# EAGLE design AudioAmp_V1 (EAGLE 6.1)
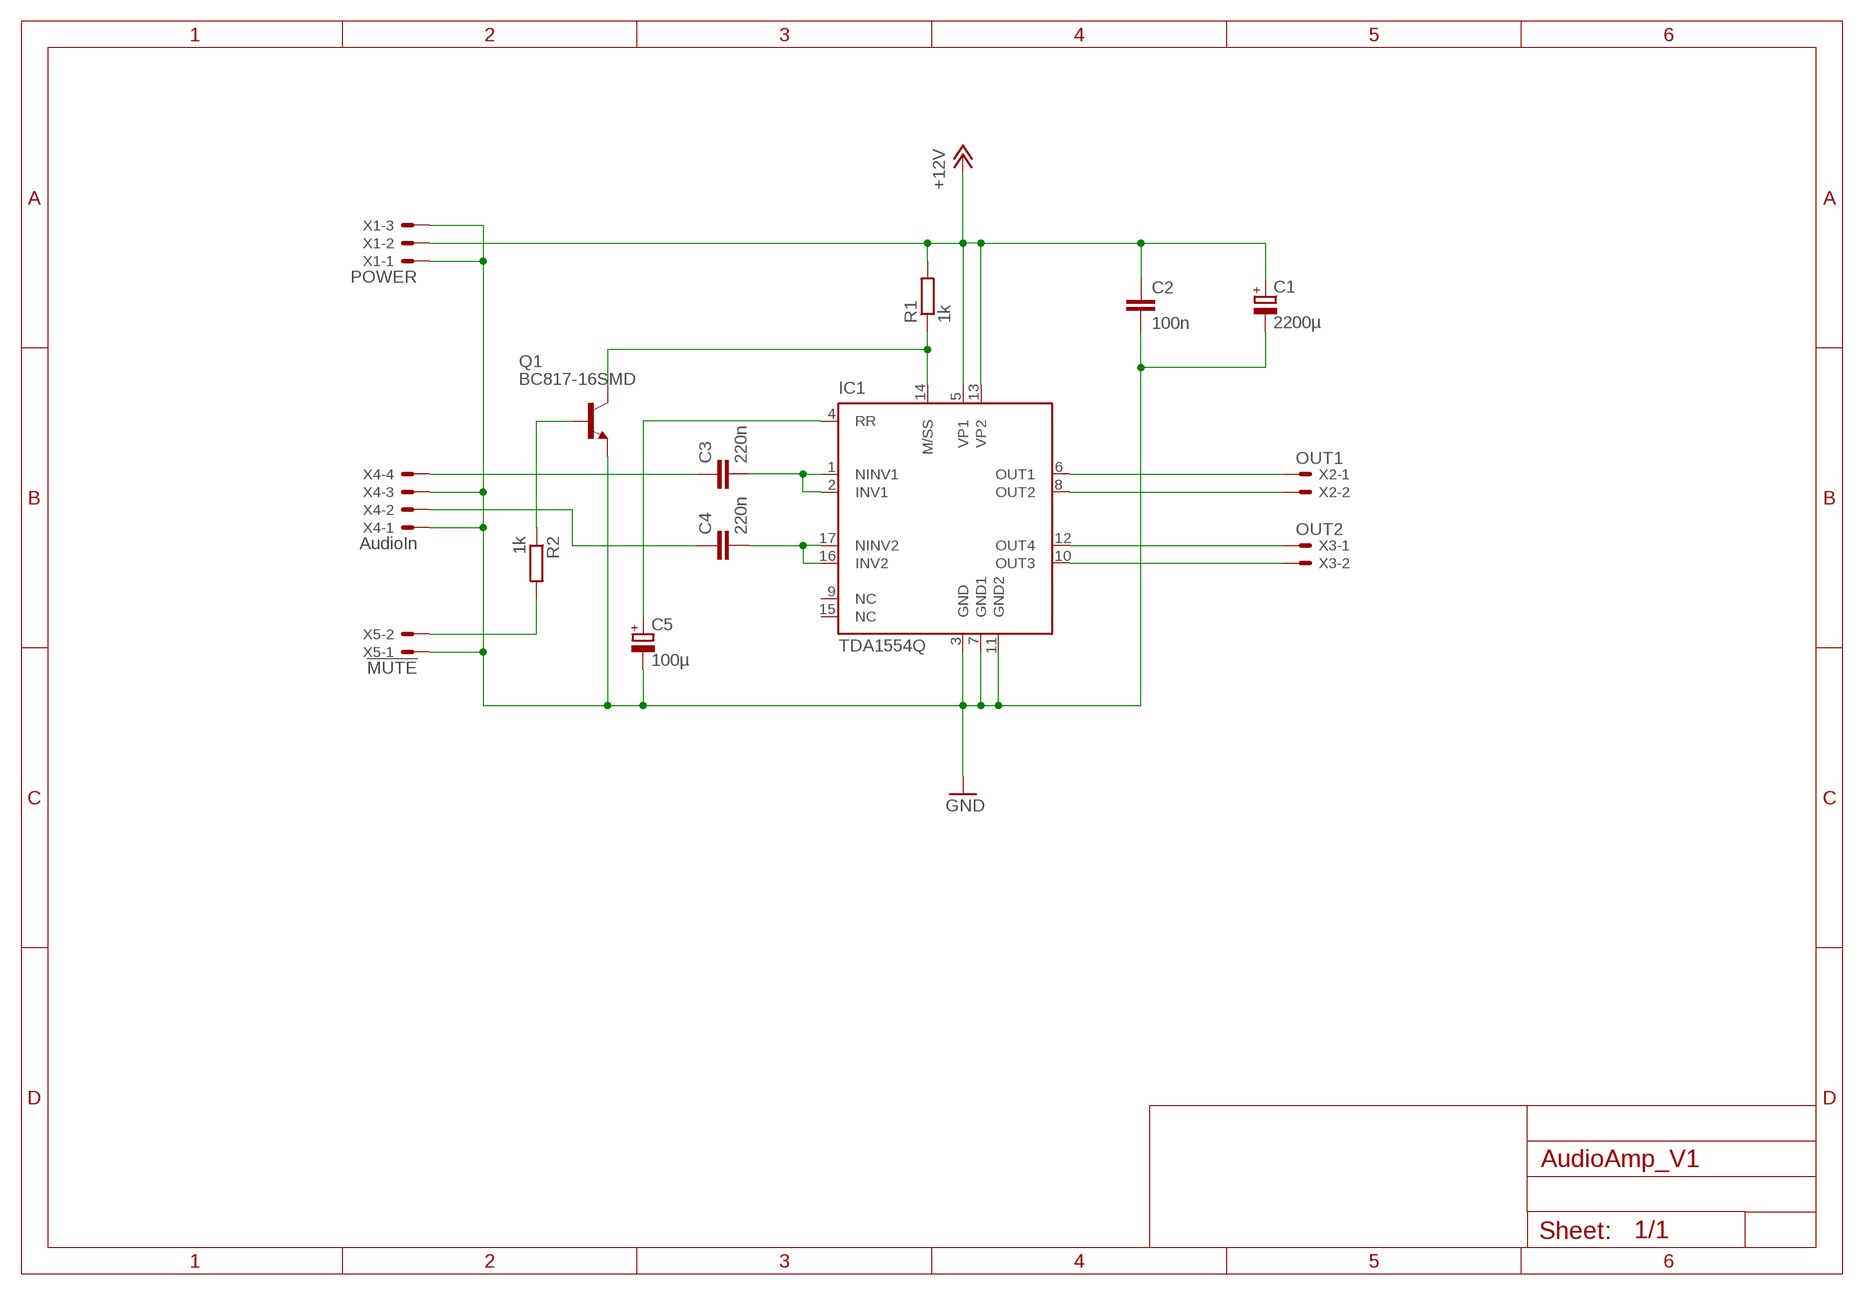
[diagram p0: schematic, sheet 1]

## Parts
C1  2200µ  CPOL-EUE7.5-18  [E7,5-18]
C2  100n  C-EU050-025X075  [C050-025X075]
C3  220n  C-EU050-025X075  [C050-025X075]
C4  220n  C-EU050-025X075  [C050-025X075]
C5  100µ  CPOL-EUE2.5-7  [E2,5-7]
IC1  TDA1554Q  [MULTIWAT-SIL17]
Q1  BC817-16SMD  [SOT23-BEC]
R1  1k  R-EU_0204/7  [0204/7]
R2  1k  R-EU_0204/7  [0204/7]
X1  POWER  22-23-2031  [22-23-2031]
X2  OUT1  22-23-2021  [22-23-2021]
X3  OUT2  22-23-2021  [22-23-2021]
X4  AudioIn  22-23-2041  [22-23-2041]
X5  !MUTE  22-23-2021  [22-23-2021]

## Nets
+12V: C1.+ C2.1 IC1.5(VP1) IC1.13(VP2) R1.2 X1.2
GND: C1.- C2.2 C5.- IC1.3(GND) IC1.7(GND1) IC1.11(GND2) Q1.E X1.1 X1.3 X4.1 X4.3 X5.1
N$1: C3.2 IC1.1(NINV1) IC1.2(INV1)
N$2: C4.2 IC1.16(INV2) IC1.17(NINV2)
N$3: R2.2 X5.2
N$4: C4.1 X4.2
N$5: C3.1 X4.4
N$6: C5.+ IC1.4(RR)
N$7: Q1.B R2.1
N$10: IC1.10(OUT3) X3.2
N$11: IC1.12(OUT4) X3.1
N$12: IC1.8(OUT2) X2.2
N$13: IC1.6(OUT1) X2.1
N$14: IC1.14(M/SS) Q1.C R1.1
Unconnected: IC1.9(NC) IC1.15(NC)

## Library data of the parts
C1 C5 = rcl:CPOL-EU: POLARIZED CAPACITOR, European symbol
C2-C4 = rcl:C-EU: CAPACITOR, European symbol
IC1 = linear2:TDA1554Q: Audio Power Amplifier 4x11W single-ended or 2x22W BTL source: TDA1554Q_CNV.pdf
Q1 = transistor-npn:BC817*: NPN Transistor
R1 R2 = rcl:R-EU_: RESISTOR, European symbol
X1 = con-molex:22-23-2031: .100" (2.54mm) Center Header - 3 Pin; MF: MOLEX; MPN: 22-23-2031; OC_FARNELL: 1462950; OC_NEWARK: 30C0862
X2 X3 X5 = con-molex:22-23-2021: .100" (2.54mm) Center Header - 2 Pin; MF: MOLEX; MPN: 22-23-2021; OC_FARNELL: 1462926; OC_NEWARK: 25C3832
X4 = con-molex:22-23-2041: .100" (2.54mm) Center Header - 4 Pin; MF: MOLEX; MPN: 22-23-2041; OC_FARNELL: 1462920; OC_NEWARK: 38C0355

## Board
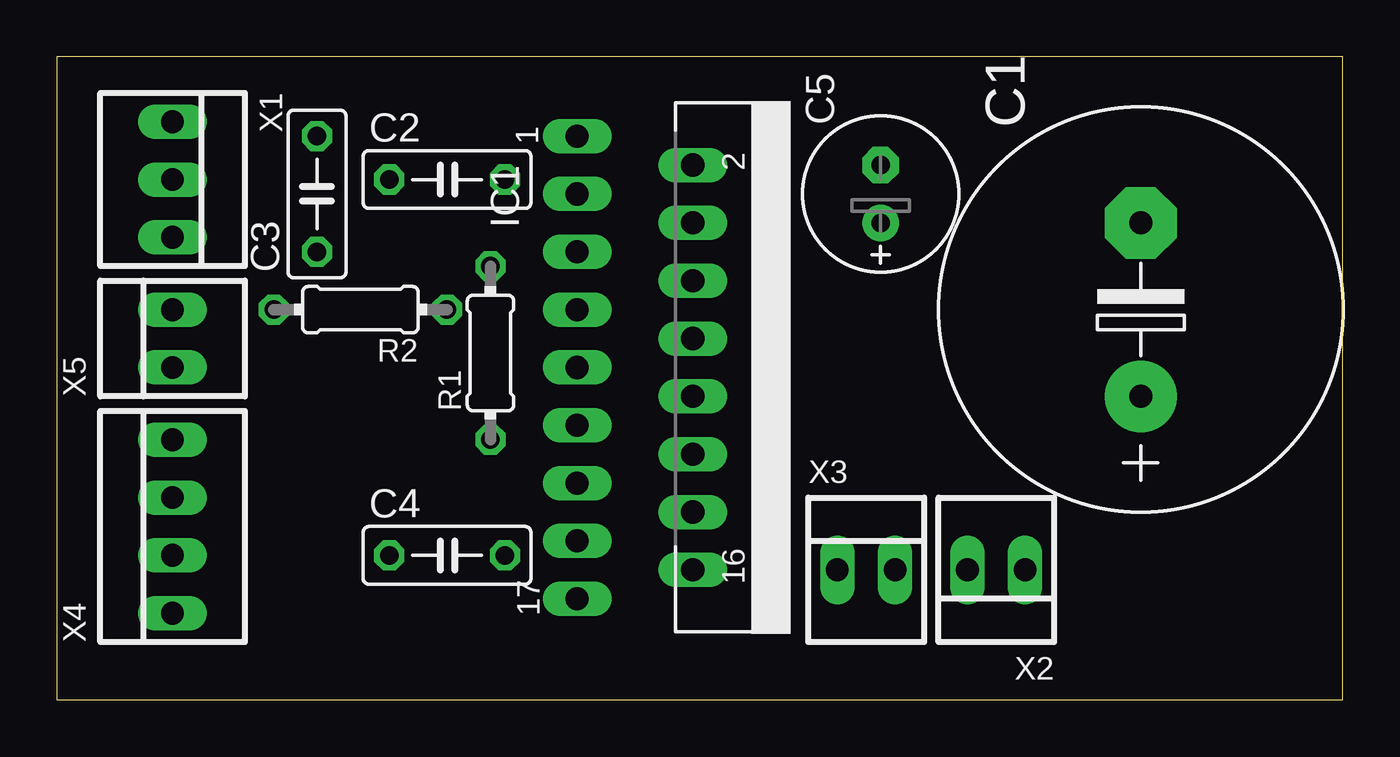
[diagram p1: board, top side]
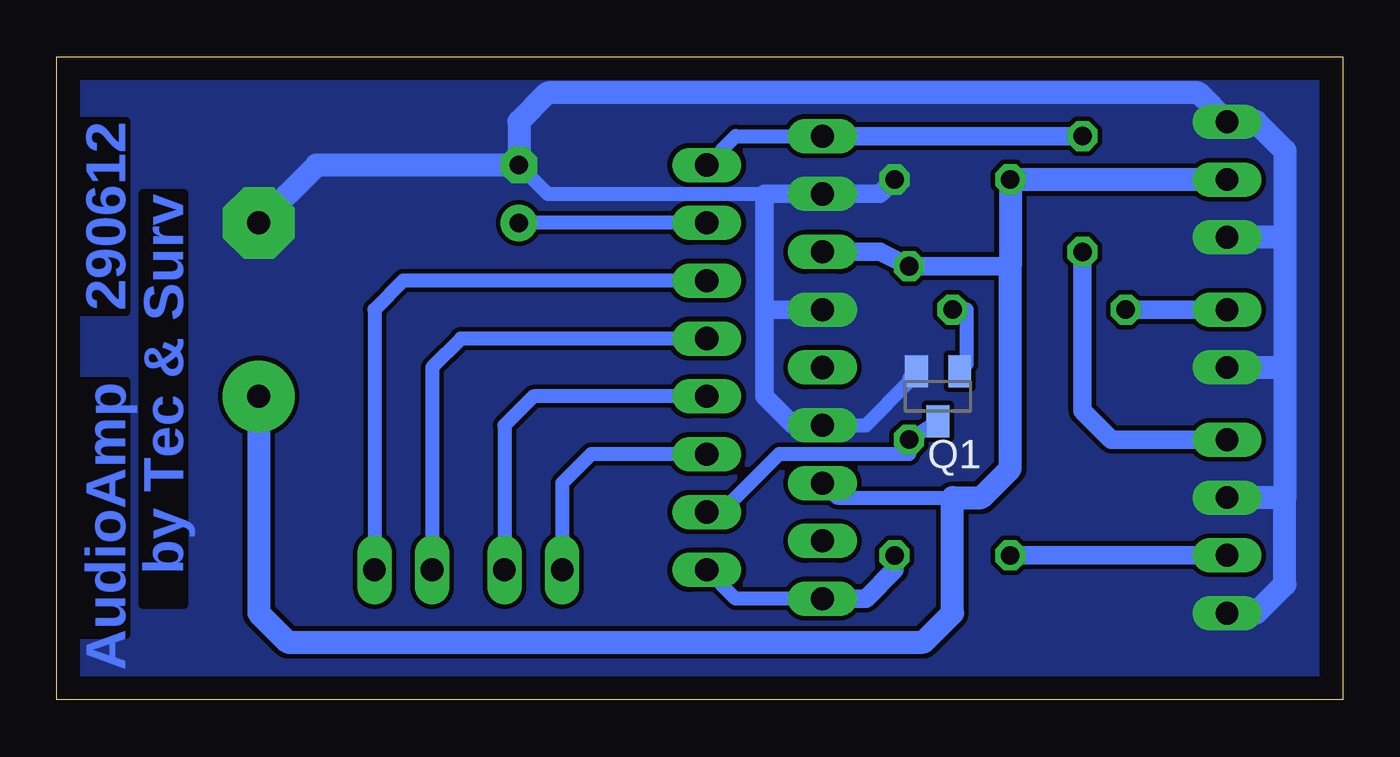
[diagram p2: board, bottom side, seen from below]

Size 56.49 x 28.25 mm. Coordinates in mm from the lower left corner, seen from the top.
Outline: 0,0 56.49,0 56.49,28.25 0,28.25 0,0
Copper layers (1*16): Top 0.035mm / dielectric 1.5mm / Bottom 0.035mm
Design rules: minimum track width 10mil, minimum drill 24mil, track to track 8mil, track to pad 8mil, pad to pad 8mil, via to via 8mil, smd to smd 8mil, copper to edge 40mil, drill to drill 8mil, minimum pad ring 10mil, minimum via ring 8mil, stop-mask expansion 4mil, vias tented up to drill 0mil, thermal gap 10mil

### Footprints (pad centres in the part's own frame; a part is rotated, then mirrored left to right if it is on the bottom)
E7,5-18 = drill 1.016 pad 3.15: + -3.81,0 | drill 1.016 pad 3.15 octagon: - 3.81,0
C050-025X075 = drill 0.813 octagon: 1 -2.54,0; 2 2.54,0
E2,5-7 = drill 0.813 pad 1.6: + -1.27,0 | drill 0.813 pad 1.6 octagon: - 1.27,0
MULTIWAT-SIL17 = drill 1.016 long: 1 -10.16,-7.62; 2 -8.89,-2.54; 3 -7.62,-7.62; 4 -6.35,-2.54; 5 -5.08,-7.62; 6 -3.81,-2.54; 7 -2.54,-7.62; 8 -1.27,-2.54; 9 0,-7.62; 10 1.27,-2.54; 11 2.54,-7.62; 12 3.81,-2.54; 13 5.08,-7.62; 14 6.35,-2.54; 15 7.62,-7.62; 16 8.89,-2.54; 17 10.16,-7.62
SOT23-BEC = smd 1 x 1.4: B -0.95,-1.1; C 0,1.1; E 0.95,-1.1
0204/7 = drill 0.813 octagon: 1 -3.81,0; 2 3.81,0
22-23-2031 = drill 1 long: 1 -2.54,0; 2 0,0; 3 2.54,0
22-23-2021 = drill 1 long: 1 -1.27,0; 2 1.27,0
22-23-2041 = drill 1 long: 1 -3.81,0; 2 -1.27,0; 3 1.27,0; 4 3.81,0

### Placement (x,y rotation side)
C1  47.62,17.15 90 top
C2  17.15,22.86 0 top
C3  11.43,22.23 90 top
C4  17.15,6.35 0 top
C5  36.2,22.23 90 top
IC1  30.48,14.61 270 top
Q1  17.78,13.33 180 bottom
R1  19.05,15.24 90 top
R2  13.33,17.15 180 top
X1  5.08,22.86 270 top
X2  41.27,5.71 180 top
X3  35.56,5.71 0 top
X4  5.08,7.62 90 top
X5  5.08,15.88 90 top

### Tracks (layer width: path | path; a pad name or v marks a point on that pad's centre or on a via)
+12V
  Bottom 0.61: IC1.13 22.23,8.89 17.15,8.89
  Bottom 0.813: 14.61,19.05 R1.2 20.32,19.69 IC1.5
  Bottom 1.016: X1.2 C2.1 14.61,19.05 14.61,10.16 15.88,8.89 17.15,8.89 17.15,3.81 18.42,2.54 46.35,2.54 47.62,3.81 C1.+
GND
  Bottom 0.61: C5.- 34.92,22.23 25.4,22.23 | IC1.11 20.96,12.06 19.05,13.97 19.05,14.12 Q1.E
  Bottom 0.813: C2.2 20.32,22.23 IC1.3 25.4,22.23 25.4,17.15 | 25.4,17.15 IC1.7 | IC1.11 24.13,12.06 25.4,13.33 25.4,17.15
  Bottom 1.016: X4.1 3.81,3.81 2.54,5.08 2.54,8.89 | 2.54,8.89 X4.3 | X5.1 2.54,14.61 | 2.54,14.61 2.54,8.89 | 2.54,20.32 2.54,24.13 3.81,25.4 X1.1 6.35,26.67 34.92,26.67 36.2,25.4 C5.- 45.09,23.5 C1.- | 2.54,20.32 2.54,14.61 | 2.54,20.32 X1.3
  pour Bottom (no thermals): 0,28.58 56.52,28.58 56.52,0 0,0
N$1
  Bottom 0.61: IC1.2 26.67,24.77 IC1.1
  Bottom 0.813: C3.2 IC1.1
N$2
  Bottom 0.61: IC1.17 26.67,4.45 IC1.16
  Bottom 0.813: C4.2 19.69,5.71 20.96,4.45 IC1.17
N$3
  Bottom 0.813: R2.2 X5.2
N$4
  Bottom 0.813: X4.2 C4.1
N$5
  Bottom 0.813: X4.4 10.16,11.43 11.43,12.7 C3.1
N$6
  Bottom 0.61: IC1.4 C5.+
N$7
  Bottom 0.61: Q1.B 16.51,14.75 16.51,17.15 R2.1
N$10
  Bottom 0.61: IC1.10 35.56,13.33 36.83,12.06 X3.2
N$11
  Bottom 0.61: IC1.12 33.02,10.79 34.29,9.53 X3.1
N$12
  Bottom 0.61: IC1.8 38.73,15.88 40,14.61 X2.2
N$13
  Bottom 0.61: IC1.6 41.27,18.42 42.54,17.15 X2.1
N$14
  Bottom 0.61: Q1.C R1.1 19.05,10.79 24.77,10.79 27.31,8.26 IC1.14

### Text on the board
Bottom: 290612 | by Tec & Surv | AudioAmp